# EAGLE schematic dc_sensor_v2 (EAGLE 6.2)
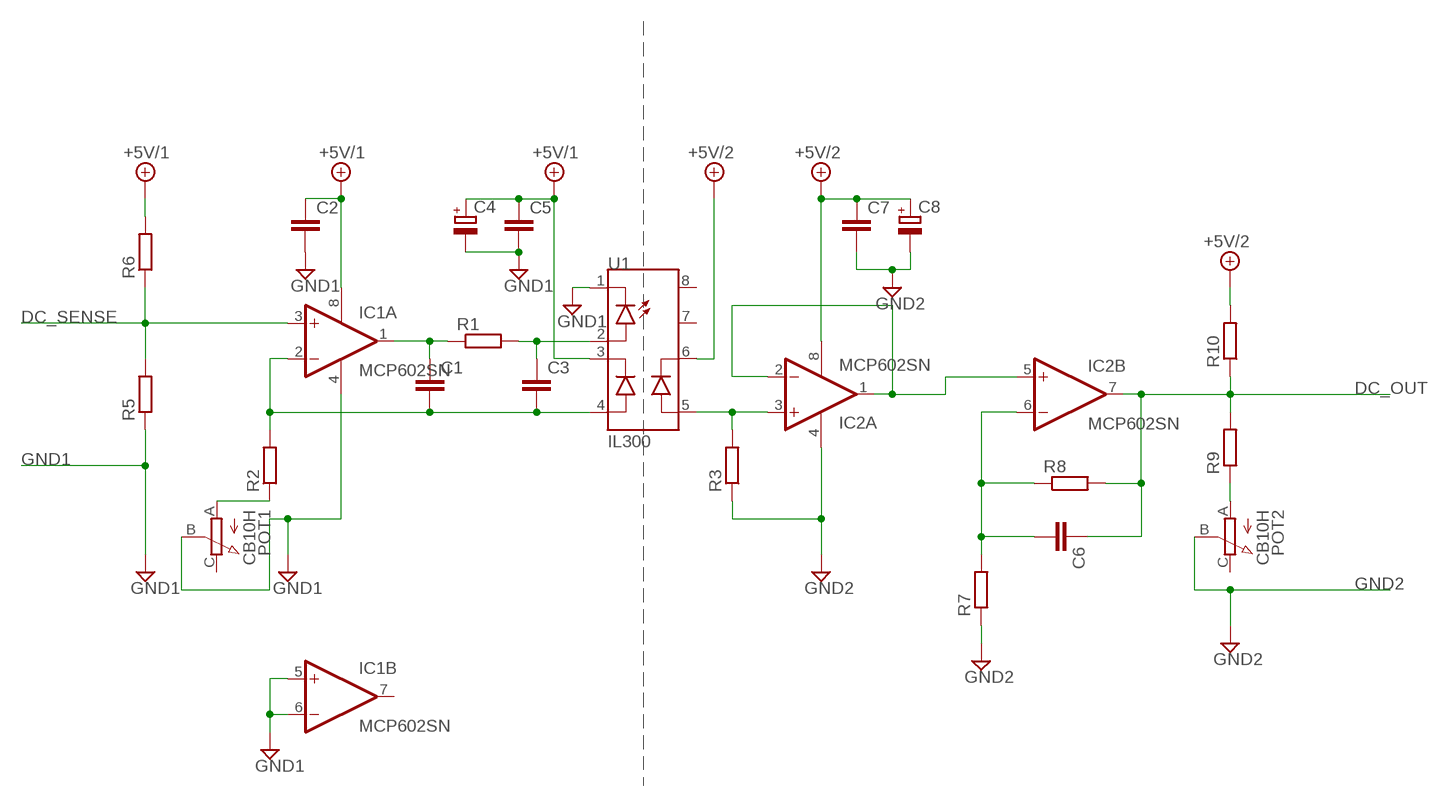
[diagram p0: schematic, sheet 1]

## Parts
C1  C-EU025-040X050  [C025-040X050]
C2  C-EU025-040X050  [C025-040X050]
C3  C-EU025-040X050  [C025-040X050]
C4  CPOL-EUE2-5  [E2-5]
C5  C-EU025-040X050  [C025-040X050]
C6  C-EU025-040X050  [C025-040X050]
C7  C-EU025-040X050  [C025-040X050]
C8  CPOL-EUE2-5  [E2-5]
IC1  MCP602SN  [SO08]
IC2  MCP602SN  [SO08]
POT1  CB10H  [CB10V]
POT2  CB10H  [CB10V]
R1  R-EU_0207/10  [0207/10]
R2  R-EU_0207/10  [0207/10]
R3  R-EU_0207/10  [0207/10]
R5  R-EU_0207/10  [0207/10]
R6  R-EU_0207/10  [0207/10]
R7  R-EU_0207/10  [0207/10]
R8  R-EU_0207/10  [0207/10]
R9  R-EU_0207/10  [0207/10]
R10  R-EU_0207/10  [0207/10]
U1  IL300  [DIL08]

## Nets
+5V/1: C2.1 C4.+ C5.1 IC1.8(P:V+) R6.2 U1.3(C_FB)
+5V/2: C7.1 C8.+ IC2.8(P:V+) R10.2 U1.6(C_OUT)
DC_OUT: C6.1 IC2.7(B:OUT) R8.2 R9.2 R10.1
DC_SENSE: IC1.3(A:+IN) R5.2 R6.1
GND1: C2.2 C4.- C5.2 IC1.4(P:V-) IC1.5(B:+IN) IC1.6(B:-IN) POT1.B(S) R5.1 U1.1(C_LED)
GND2: C7.2 C8.- IC2.4(P:V-) POT2.B(S) R3.1 R7.1
N$1: C1.2 C3.2 IC1.2(A:-IN) R2.2 U1.4(A_FB)
N$2: POT2.A R9.1
N$3: IC2.3(A:+IN) R3.2 U1.5(A_OUT)
N$4: C3.1 R1.2 U1.2(A_LED)
N$5: C1.1 IC1.1(A:OUT) R1.1
N$6: IC2.1(A:OUT) IC2.2(A:-IN) IC2.5(B:+IN)
N$7: POT1.A R2.1
N$10: C6.2 IC2.6(B:-IN) R7.2 R8.1
Unconnected: IC1.7(B:OUT) POT1.C(E) POT2.C(E) U1.7(PIN7) U1.8(PIN8)

## Library data of the parts
C1-C3 C5-C7 = resistor:C-EU: CAPACITOR, European symbol
C4 C8 = resistor:CPOL-EU: POLARIZED CAPACITOR, European symbol
IC1 IC2 = linear:MCP602: Single Op Amp 2.7V to 6.0V Single Supply CMOS Source: http://ww1.microchip.com/downloads/en/DeviceDoc/21314g.pdf
POT1 POT2 = passive-trimmer:CB10H: http://onecall.farnell.com/jsp/search/browse.jsp;jsessionid=SRTOMW5W3RDHYCQLCIQZOXQ?N=411&Ntk=gensearch&Ntt=CB10*V&Ntx=mode+matchallpartial&exposeLevel2Refinement=true&suggestions=false&ref=globalsearch&_requestid=163591 http://www.tycoelectronics.com/commerce/DocumentDelivery/DDEController?Action=srchrtrv&DocNm=1773190&DocType=Data+Sheet&DocLang=English
R1-R3 R5-R10 = resistor:R-EU_: RESISTOR, European symbol
U1 = ic-optoisolator:IL300